# Altium project current_transmitter.PrjPcb
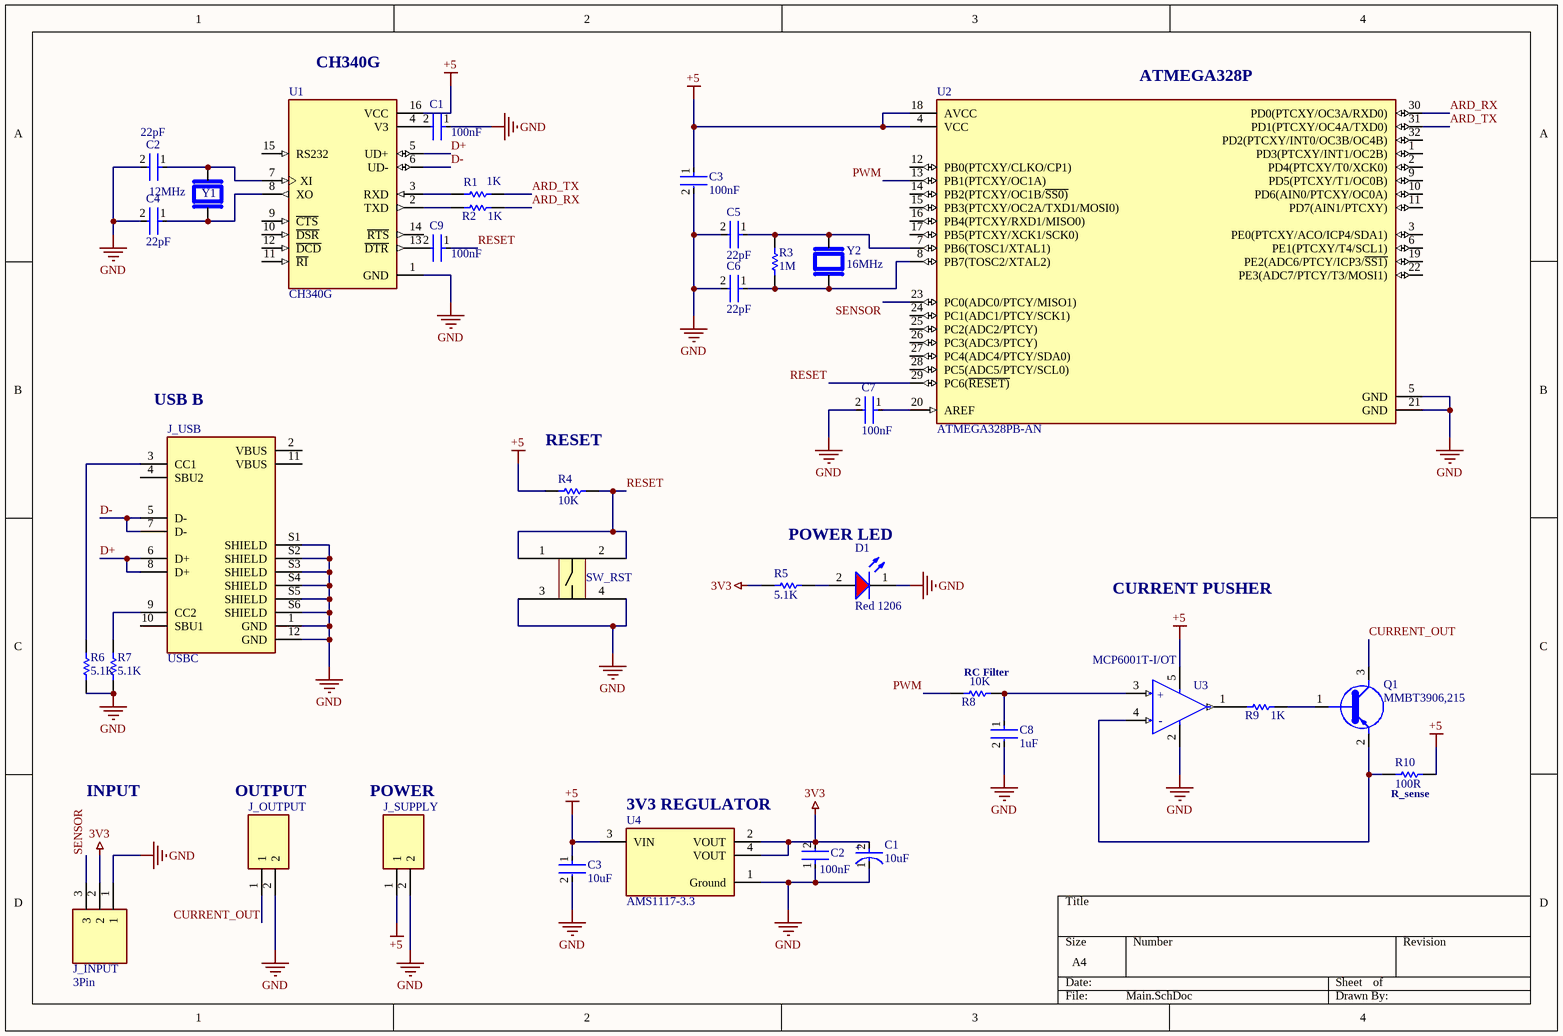
[diagram p0: Main.SchDoc]
1 sheet, 35 parts. Net scope: global (net labels, ports and power ports of the same name join across sheets).
Board file: PCB1.PcbDoc

## Sheet Main.SchDoc
size A4; SheetNumber: 1; SheetTotal: 1

### Parts
(Parts that share a designator on the sheet are numbered #1, #2 ... from top to bottom, then left to right.)
C1#1  100nF  [FP-CGA3E-0_3-0_1-IPC_A]
C1#2  10uF  [FP-FKB-MFG]
C2#1  22pF  [FP-CGA3E-0_3-0_1-IPC_A]
C2#2  100nF  [FP-1206-L_3_2_0_2-W_1_6_0-MFG]
C3#1  100nF  [FP-CGA3E-0_3-0_1-IPC_A]
C3#2  10uF  [FP-C3216-160-0_2-IPC_A]
C4  22pF  [FP-CGA3E-0_3-0_1-IPC_A]
C5  22pF  [FP-CGA3E-0_3-0_1-IPC_A]
C6  22pF  [FP-CGA3E-0_3-0_1-IPC_A]
C7  100nF  [FP-CGA3E-0_3-0_1-IPC_A]
C8  1uF  [FP-CGA3E-0_3-0_1-IPC_A]
C9  100nF  [FP-CGA3E-0_3-0_1-IPC_A]
D1  Red 1206  [WL-SMCW_1206_150120xx75000]
J_INPUT  3Pin  [15EDGRC-3.81-03P]
J_OUTPUT  15EDGRC-3.81-02P  [15EDGRC-3.81-02P]  (value not drawn)
J_SUPPLY  15EDGRC-3.81-02P  [15EDGRC-3.81-02P]  (value not drawn)
J_USB  USBC  [JAE_DX07S016JA1R1500]
Q1  MMBT3906,215  [SOT95P230X110-3N]
R1  1K  [RESC1608X55X30LL15T15]
R2  1K  [RESC1608X55X30LL15T15]
R3  1M  [RESC1608X55X30LL15T15]
R4  10K  [RESC1608X55X30LL15T15]
R5  5.1K  [RESC1608X55X30LL15T15]
R6  5.1K  [RESC1608X55X30LL15T15]
R7  5.1K  [RESC1608X55X30LL15T15]
R8  10K  [RESC1608X55X30LL15T15]
R9  1K  [RESC1608X55X30LL15T15]
R10  100R  [RESC3216X70X50NL05T20]
SW_RST  3x4x2.5_TACTILE_BUTTON  [3x4x2.5_TACTILE_BUTTON]  (value not drawn)
U1  CH340G  [SOIC127P600X180-16N]
U2  ATMEGA328PB-AN  [FP-C04-074-MFG]
U3  MCP6001T-I/OT  [FP-C04-091-OT-IPC_A]
U4  AMS1117-3.3  [FP-AMS1117-IPC_C]
Y1  12MHz  [XTAL_HC49P488W46L1150T500H350]
Y2  16MHz  [XTAL_HC49P488W46L1150T500H350]

### Nets
3V3: C1#2.2(A) C2#2.2 J_INPUT.2 R5.1 U4.2(VOUT) U4.4(VOUT)
+5: C3#1.1 C3#2.1 J_SUPPLY.1 R4.2 R10.1 U1.16(VCC) U2.4(VCC) U2.18(AVCC) U3.5(VDD) U4.3(VIN)
GND: C1#1.1 C1#2.1(C) C2#1.2 C2#2.1 C3#1.2 C3#2.2 C4.2 C5.2 C6.2 C7.2 C8.2 D1.1(K) J_INPUT.1 J_OUTPUT.2 J_SUPPLY.2 J_USB.1(GND) J_USB.12(GND) J_USB.S1(SHIELD) J_USB.S2(SHIELD) J_USB.S3(SHIELD) J_USB.S4(SHIELD) J_USB.S5(SHIELD) J_USB.S6(SHIELD) R6.1 R7.1 SW_RST.3 SW_RST.4 U1.1(GND) U2.5(GND) U2.21(GND) U3.2(VSS) U4.1(Ground)
ARD_RX: R2.1 U2.30(PD0(PTCXY/OC3A/RXD0))
ARD_TX: R1.1 U2.31(PD1(PTCXY/OC4A/TXD0))
CURRENT_OUT: J_OUTPUT.1 Q1.3(C)
D+: J_USB.6(D+) J_USB.8(D+) U1.5(UD+)
D-: J_USB.5(D-) J_USB.7(D-) U1.6(UD-)
PWM: R8.2 U2.13(PB1(PTCXY/OC1A))
RESET: C9.1 R4.1 SW_RST.1 SW_RST.2 U2.29(PC6(~{RESET)})
SENSOR: J_INPUT.3 U2.23(PC0(ADC0/PTCY/MISO1))
NetC1#1_2: C1#1.2 U1.4(V3)
NetC2#1_1: C2#1.1 U1.7(XI) Y1.1
NetC4_1: C4.1 U1.8(XO) Y1.2
NetC5_1: C5.1 R3.1 U2.7(PB6(TOSC1/XTAL1)) Y2.1
NetC6_1: C6.1 R3.2 U2.8(PB7(TOSC2/XTAL2)) Y2.2
NetC7_1: C7.1 U2.20(AREF)
NetC8_1: C8.1 R8.1 U3.3(VIN+)
NetC9_2: C9.2 U1.13(~{DTR})
NetD1_2: D1.2(A) R5.2
NetJ_USB_3: J_USB.3(CC1) R6.2
NetJ_USB_9: J_USB.9(CC2) R7.2
NetQ1_1: Q1.1(B) R9.1
NetQ1_2: Q1.2(E) R10.2 U3.4(VIN-)
NetR1_2: R1.2 U1.3(RXD)
NetR2_2: R2.2 U1.2(TXD)
NetR9_2: R9.2 U3.1(VOUT)

Not connected (* = marked no-connect by the designer): J_USB 2(VBUS) 4(SBU2) 10(SBU1) 11(VBUS); U1 9(~{CTS}) 10(~{DSR}) 11(~{RI}) 12(~{DCD}) 14(~{RTS}) 15(RS232); U2 1(PD3(PTCXY/INT1/OC2B)) 2(PD4(PTCXY/T0/XCK0)) 3(PE0(PTCXY/ACO/ICP4/SDA1)) 6(PE1(PTCXY/T4/SCL1)) 9(PD5(PTCXY/T1/OC0B)) 10(PD6(AIN0/PTCXY/OC0A)) 11(PD7(AIN1/PTCXY)) 12(PB0(PTCXY/CLKO/CP1)) 14(PB2(PTCXY/OC1B/~{SS0)}) 15(PB3(PTCXY/OC2A/TXD1/MOSI0)) 16(PB4(PTCXY/RXD1/MISO0)) 17(PB5(PTCXY/XCK1/SCK0)) 19(PE2(ADC6/PTCY/ICP3/~{SS1)}) 22(PE3(ADC7/PTCY/T3/MOSI1)) 24(PC1(ADC1/PTCY/SCK1)) 25(PC2(ADC2/PTCY)) 26(PC3(ADC3/PTCY)) 27(PC4(ADC4/PTCY/SDA0)) 28(PC5(ADC5/PTCY/SCL0)) 32(PD2(PTCXY/INT0/OC3B/OC4B))

### Notes on the sheet
- (near U1) CH340G
- (near U2) ATMEGA328P
- (near J_USB) USB B
- (near R4) RESET
- POWER LED
- CURRENT PUSHER
- (near R8) RC Filter
- INPUT
- OUTPUT
- POWER
- (near U4) 3V3 REGULATOR
- (near R10) R_sense
- (in symbol CMP-0187-00462-3) +; -
- (in symbol CMP-2000-06211-2) +

### Library data of the parts
C1#1 C2#1 C3#1 C4-C9 = CMP-2000-07546-2: Cap Ceramic 100nF 50V X7R 10% Pad SMD 0603 +125°C Automotive T/R; Weight: 7.1E-05oz; Composition: Ceramic; Max Operating Temperature: 125°C; Termination: SMD/SMT; Dielectric: X7R; Length: 1.6mm; Package Quantity: 1; REACH SVHC: No SVHC; Lead Free: Lead Free; Case Code (Metric): 1608; Min Operating Temperature: -55°C; Packaging: Tape and Reel; Tolerance: 10%; Voltage Rating: 50V; Case Code (Imperial): 0603; Capacitance: 100nF; Case/Package: 0603; Voltage Rating (DC): 50V; Depth: 0.8mm; Radiation Hardening: No; Ratings: AEC-Q200; Mount: Surface Mount; Voltage: 50V; Thickness: 0.035inch; Width: 0.8mm; Height: 0.8mm
C1#2 = CMP-2000-06211-2: CAP ALUM 10UF 20% 35V SMD; ESR (Equivalent Series Resistance): 1.35R; Ripple Current: 90mA; Leakage Current: 3uA; Polarity: Polar; Material: Aluminium; Life (Hours): 2000Hour; Height: 5.8mm; Voltage Rating: 35V; Max Operating Temperature: 105°C; Ripple Current (AC): 90mA; Voltage: 35V; Height - Seated (Max): 0.24inch; Lead Free: Lead Free; Contact Plating: Tin; Capacitance: 10uF; Series: FK; REACH SVHC: No SVHC; Construction: Cylindrical; Tolerance: 20%; Voltage Rating (DC): 35V; Number of Pins: 2; Packaging: Tape and Reel; RoHS Compliant: Yes; Min Operating Temperature: -55°C; Impedance: 1.35R; Package Quantity: 1; Termination: SMD/SMT; Length: 5.8mm; Case/Package: Radial; Diameter: 4mm; Radiation Hardening: No; Width: 5.5mm; Mount: Surface Mount
C2#2 = CMP-2000-05018-2: General Purpose Ceramic Capacitor, 1206, 100nF, 10%, X7R, 15%, 50V; Dissipation Factor: 2.5%; Insulation Resistance: 100GR; Dielectric: X7R; Thickness: 0.037inch; Case Code (Imperial): 1206; Case Code (Metric): 3216; Dielectric Material: Ceramic; Width: 1.6mm; Voltage Rating (DC): 50V; Termination: SMD/SMT; Tolerance: 10%; REACH SVHC: No SVHC; Height: 0.94mm; Length: 3.2mm; Voltage: 50V; Capacitance: 100nF; Packaging: Tape and Reel; Depth: 1.6mm; Voltage Rating: 50V; Series: -; Contact Plating: Tin; Mount: Surface Mount; Package Quantity: 1; Construction: Flat; Max Operating Temperature: 125°C; Min Operating Temperature: -55°C; Case/Package: 1206; Lead Free: Lead Free; RoHS Compliant: Yes; Number of Pins: 2; Radiation Hardening: No
C3#2 = CMP-2000-06045-2: Multilayer Ceramic Capacitors 10uF ±10% 50V X5R SMD 1206; Min Operating Temperature: -55°C; Weight: 0.000571oz; Tolerance: 10%; Lead Free: Lead Free; REACH SVHC: No SVHC; Dielectric Material: Ceramic; Termination: SMD/SMT; Radiation Hardening: No; Case Code (Metric): 3216; Max Operating Temperature: 85°C; Voltage Rating (DC): 50V; Packaging: Tape and Reel; Height: 1.6mm; Voltage: 50V; Dielectric: X5R; Mount: Surface Mount; Voltage Rating: 50V; Capacitance: 10uF; Length: 3.2mm; RoHS Compliant: Yes; Thickness: 0.071inch; Depth: 1.6mm; Width: 0.063inch; Case/Package: 1206; Series: C; Package Quantity: 1; Resistor Type: Ceramic; Case Code (Imperial): 1206; Construction: Flat
D1 = CMP-1426-00017-3: Led, Red, 630 Nm, 1.9 V, 30 Ma, 60 Mcd Rohs Compliant: Yes; Forward Current: 100mA; Max Reverse Voltage (DC): 5V; Lens Style: Clear, Rectangular; Viewing Angle: 140°; Luminous Intensity: 60mcd; Peak Wavelength: 645nm; Forward Voltage: 1.9V; Test Current: 20mA; Dominant Wavelength: 630nm; Case Code (Imperial): 1206; Length: 3.2mm; Mount: Surface Mount; Case Code (Metric): 3216; Case/Package: 1206; Min Operating Temperature: -40°C; Width: 1.6mm; Color: Red; Height: 680µm; REACH SVHC: Unknown; Max Operating Temperature: 85°C; Wavelength: 630nm; RoHS: Compliant; Packaging: Tape and Reel
J_INPUT = 15EDGRC-3.81-03P: Manufacturer_Name: Degson; Manufacturer_Part_Number: 15EDGRC-3.81-02P-14-00A(H); Geometry.Height: 7.2mm; Mouser Part Number: *; Mouser Price/Stock: *; Arrow Part Number: *; Arrow Price/Stock: *; Datasheet Link: https://www.tme.com/uz/ru/details/15edgrc3.81-02p/klemmnye-kolodki-razemnogo-tipa/degson-electronics/15edgrc-3-81-02p-14-00a-h/
J_OUTPUT J_SUPPLY = 15EDGRC-3.81-02P: Manufacturer_Name: Degson; Manufacturer_Part_Number: 15EDGRC-3.81-02P-14-00A(H); Geometry.Height: 7.2mm; Mouser Part Number: *; Mouser Price/Stock: *; Arrow Part Number: *; Arrow Price/Stock: *; Datasheet Link: https://www.tme.com/uz/ru/details/15edgrc3.81-02p/klemmnye-kolodki-razemnogo-tipa/degson-electronics/15edgrc-3-81-02p-14-00a-h/
J_USB = DX07S016JA1R1500: USB-C (USB TYPE-C) USB 2.0 Receptacle Connector 24 (16+8 Dummy) Position Surface Mount, Right Angle; Through Hole; Package: None; Value: *; Price: None; MP: DX07S016JA1R1500; Availability: Unavailable
Q1 = MMBT3906,215: Bipolar (BJT) Transistor PNP 40 V 200 mA 250MHz 250 mW Surface Mount TO-236AB; MF: Nexperia USA; SnapEDA_Link: https://www.snapeda.com/parts/MMBT3906,215/Nexperia/view-part/?ref=snap; Package: SOT23-3 Nexperia USA Inc.; Value: *; MP: MMBT3906,215; Check_prices: https://www.snapeda.com/parts/MMBT3906,215/Nexperia/view-part/?ref=eda
R1-R9 = CMP-2000-00803-1: Part Number: ERJ-3GEYJ512V; Manufacturer: Panasonic
R10 = CMP-2003-00592-1: Part Number: ERJ-8GEYJ241V; Manufacturer: Panasonic
U1 = CH340G: USB Interface Integrated Circuit; MF: WCH; Value: *; SnapEDA_Link: https://www.snapeda.com/parts/Ch340G/WCH/view-part/?ref=snap; MP: Ch340G; Check_prices: https://www.snapeda.com/parts/Ch340G/WCH/view-part/?ref=eda; Availability: Not in stock; Price: None; Package: None
U2 = CMP-06276-000029-1: IC MCU 8BIT 32KB FLASH 32TQFP; Manufacturer: Microchip; Nominal Supply Current: 0.06-5.2mA; Core Architecture: AVR; Ram Size: 2KBytes; Description: AVR 32KBytes Flash, 1KBytes EEPROM, 2KBytes RAM, w - 20MHZ, TQFP, Extended TEMP, GREEN 5 V; Interface: I2C,SPI,USART,2-Wire; Number Of I2C Channels: 2; Max Supply Voltage: 5.5V; Frequency: 20MHz; Standoff Height: 0.05mm; Number Of I/Os: 27; Number Of A/D Converters: 1; Memory Size: 32KBytes; Number Of Pwm Channels: 10; Number Of Adc Channels: 8; Data Bus Width: 8bits; Min Supply Voltage: 1.8V; Number Of Timers/Counters: 5; Category: IC; Memory Type: FLASH; Package: C04-074; Lead Free: Yes; Mouser Description: AVR 32KBytes Flash, 1KBytes EEPROM, 2KBytes RAM, w - 20MHZ, TQFP, Extended TEMP, GREEN 5 V; Ipc Land Pattern Name: QFP80P900X900X120-32; Temperature Range Low: -40°C; Manufacturer Part Number: ATMEGA328PB-AN; Number Of Spi Channels: 2; Automotive: No; Footprint Url: https://ww1.microchip.com/downloads/en/DeviceDoc/32L_TQFP_7x7_PT_C04-0074B.pdf; Number Of Uart Channels: 2; Temperature: -40°C to +105°C; Device Class L3: Microcontrollers; Height: 1.2mm; Octopart: https://octopart.com/atmega328pb-an-microchip-77760226; Digikey Description: IC MCU 8BIT 32KB FLASH 32TQFP; RoHS: TRUE; Device Class L1: Integrated Circuits (ICs); Temperature Range High: +105°C; Device Class L2: Embedded Processors and Controllers; ComponentLink2URL: http://www.microchip.com/mymicrochip/filehandler.aspx?ddocname=en589665; ComponentLink2Description: Datasheet; Number Of Cores: 1
U3 = CMP-0187-00462-3: IC OPAMP GP 1 CIRCUIT SOT23-5; Number of Amplifiers: 1; Voltage: 6V; Power Supply Rejection Ratio (PSRR): 86dB; Common Mode Rejection Ratio: 60dB; Unity Gain Bandwidth Product: 1MHz; Slew Rate: 0.6V/µs; Output Current per Channel: 23mA; Nominal Supply Current: 100uA; Input Offset Voltage (Vos): 4.5mV; Input Bias Current: 1pA; Operating Supply Voltage: 5.5V; Min Supply Voltage: 1.8V; Voltage Gain: 112dB; Length: 3.1mm; REACH SVHC: No SVHC; Number of Pins: 5; Package Quantity: 1; Radiation Hardening: No; Mount: Surface Mount; Number of Circuits: 1; Number of Elements: 1; Output Current: 23mA; Packaging: Tape and Reel; Height: 1.3mm; Lead Free: Lead Free; Min Operating Temperature: -40°C; Bandwidth: 1MHz; Contact Plating: Tin; Max Supply Voltage: 6V; Max Operating Temperature: 85°C; Width: 1.8mm; Case/Package: SOT-23; Operating Supply Current: 100uA; Number of Channels: 1; Gain Bandwidth Product: 1MHz
U4 = CMP-209535-000001-1: LDO Voltage Regulators 1A, 3.3V; Manufacturer: Advanced Monolithic Systems; Dropout Voltage: 1.1V; Output Type: Fixed; Nominal Supply Current: 5mA; Max Power Dissipation: 1.2W; Max Supply Voltage: 15V; Number Of Outputs: 1; Standoff Height: 0.64mm; Max Junction Temp: +125°C; Height: 1.8mm; Package: AMS1117; Device Class L2: Power Management ICs; ComponentLink2Description: Datasheet; ComponentLink2URL: http://www.advanced-monolithic.com/pdf/ds1117.pdf; Category: IC; RoHS: TRUE; Automotive: No; Device Class L1: Integrated Circuits (ICs); Output Current: 1A; Device Class L3: Voltage Regulators - Linear; Temperature: -40°C to +125°C; Output Voltage: 3.3V; Manufacturer Part Number: AMS1117-3.3; Temperature Range Low: -40°C; Octopart: https://octopart.com/ams1117-3.3-advanced+monolithic+systems-25899300; Lead Free: Yes; Ipc Land Pattern Name: SOT229P700X180-4; Temperature Range High: +125°C
Y1 Y2 = ABL-16.000MHZ-B2-T: HC/49US (AT49) MICROPROCESSOR CRYSTAL; MF: Abracon; Price: None; SnapEDA_Link: https://www.snapeda.com/parts/ABL-16.000MHZ-B2/Abracon+LLC/view-part/?ref=snap; MP: ABL-16.000MHZ-B2; Purchase-URL: https://pricing.snapeda.com/search/part/ABL-16.000MHZ-B2/?ref=eda; Value: *; Availability: In Stock; Package: HC-49/US ABRACON; Check_prices: https://www.snapeda.com/parts/ABL-16.000MHZ-B2/Abracon+LLC/view-part/?ref=eda